# Altium schematic sheet Sheet0-MCU.SchDoc
size A4; SheetNumber: 1; SheetTotal: 4
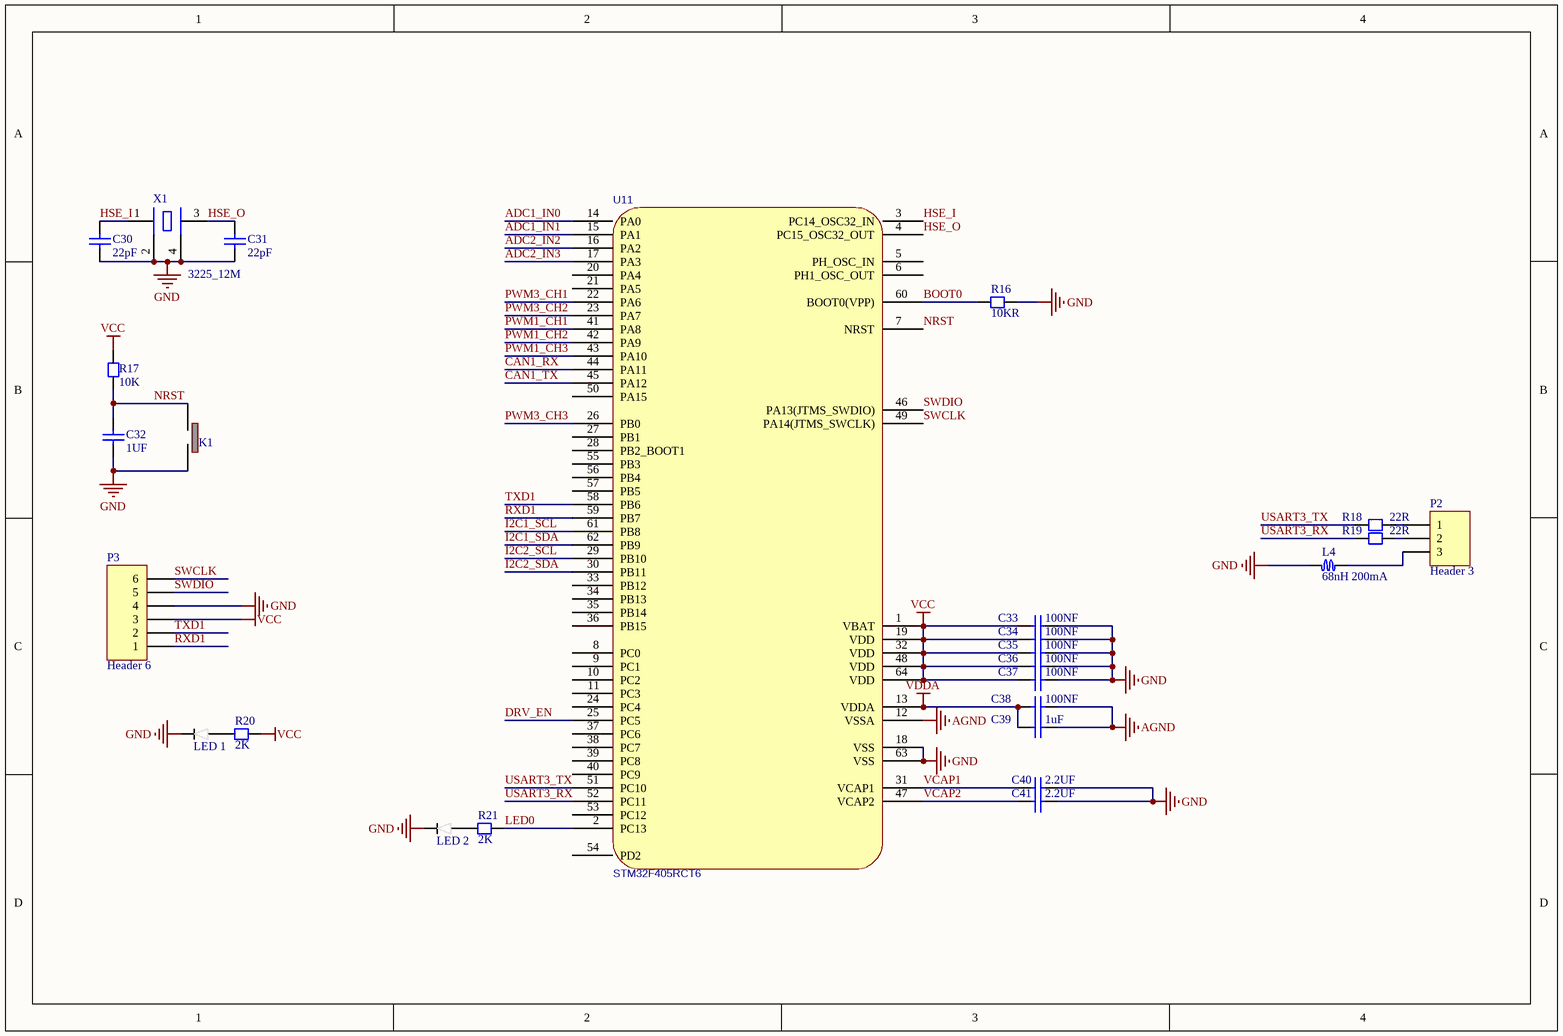
[diagram p0: Sheet0-MCU.SchDoc]

## Parts
C30  22pF  [CC1608-0603]
C31  22pF  [CC1608-0603]
C32  1UF  [CC1608-0603]
C33  100NF  [CC1608-0603]
C34  100NF  [CC1608-0603]
C35  100NF  [CC1608-0603]
C36  100NF  [CC1608-0603]
C37  100NF  [CC1608-0603]
C38  100NF  [CC1608-0603]
C39  1uF  [CC1608-0603]
C40  2.2UF  [CC1608-0603]
C41  2.2UF  [CC1608-0603]
K1  KEY 3*4  [KEY 3*4]  (value not drawn)
L4  68nH 200mA  [Inductor-0603]
LED_1  LED 0603  [LED 0603]  (value not drawn)
LED_2  LED 0603  [LED 0603]  (value not drawn)
P2  Header 3  [HX2.54-3]
P3  Header 6  [HDR1X6]
R16  10KR  [CR1608-0603]
R17  10K  [CR1608-0603]
R18  22R  [CR1608-0603]
R19  22R  [CR1608-0603]
R20  2K  [CR1608-0603]
R21  2K  [CR1608-0603]
U11  STM32F405RCT6  [LQFNP64]
X1  3225_12M  [XTAL-3225]

## Nets
AGND: C38.1 C39.1 U11.12(VSSA)
GND: C30.1 C31.1 C32.1 C33.1 C34.1 C35.1 C36.1 C37.1 C40.2 C41.1 K1.2 L4.2 LED_1.2 LED_2.2 P3.4 R16.1 U11.18(VSS) U11.63(VSS) X1.2(GND) X1.4(GND)
VCC: C33.2 C34.2 C35.2 C36.2 C37.2 P3.3 R17.2 R20.2 U11.1(VBAT) U11.19(VDD) U11.32(VDD) U11.48(VDD) U11.64(VDD)
VDDA: C38.2 C39.2 U11.13(VDDA)
ADC1_IN0: U11.14(PA0)
ADC1_IN1: U11.15(PA1)
ADC2_IN2: U11.16(PA2)
ADC2_IN3: U11.17(PA3)
BOOT0: R16.2 U11.60(BOOT0(VPP))
CAN1_RX: U11.44(PA11)
CAN1_TX: U11.45(PA12)
DRV_EN: U11.25(PC5)
HSE_I: C30.2 U11.3(PC14_OSC32_IN) X1.1(OSC1)
HSE_O: C31.2 U11.4(PC15_OSC32_OUT) X1.3(OSC2)
I2C1_SCL: U11.61(PB8)
I2C1_SDA: U11.62(PB9)
I2C2_SCL: U11.29(PB10)
I2C2_SDA: U11.30(PB11)
LED0: R21.2 U11.2(PC13)
NRST: C32.2 K1.1 R17.1 U11.7(NRST)
PWM1_CH1: U11.41(PA8)
PWM1_CH2: U11.42(PA9)
PWM1_CH3: U11.43(PA10)
PWM3_CH1: U11.22(PA6)
PWM3_CH2: U11.23(PA7)
PWM3_CH3: U11.26(PB0)
RXD1: P3.1 U11.59(PB7)
SWCLK: P3.6 U11.49(PA14(JTMS_SWCLK))
SWDIO: P3.5 U11.46(PA13(JTMS_SWDIO))
TXD1: P3.2 U11.58(PB6)
USART3_RX: R19.1 U11.52(PC11)
USART3_TX: R18.1 U11.51(PC10)
VCAP1: C40.1 U11.31(VCAP1)
VCAP2: C41.2 U11.47(VCAP2)
NetL4_1: L4.1 P2.3
NetLED_1_1: LED_1.1 R20.1
NetLED_2_1: LED_2.1 R21.1
NetP2_1: P2.1 R18.2
NetP2_2: P2.2 R19.2

Not connected (* = marked no-connect by the designer): U11 5(PH_OSC_IN) 6(PH1_OSC_OUT) 8(PC0) 9(PC1) 10(PC2) 11(PC3) 20(PA4) 21(PA5) 24(PC4) 27(PB1) 28(PB2_BOOT1) 33(PB12) 34(PB13) 35(PB14) 36(PB15) 37(PC6) 38(PC7) 39(PC8) 40(PC9) 50(PA15) 53(PC12) 54(PD2) 55(PB3) 56(PB4) 57(PB5)

## Library data of the parts
C30-C41 = Cap Chip 0603: 0603封装的电容; Published: 8-Jun-2000; Revision: July-2002: Re-released for DXP Platform.; Publisher: Altium Limited
K1 = KEY 3*4: 轻触开关按键
L4 = Inductor-0603: 贴片电感 0603封装
P2 = Header 3: Header, 3-Pin; LatestRevisionDate: 17-Jul-2002; LatestRevisionNote: Re-released for DXP Platform.; Publisher: Altium Limited
P3 = Header 6: Header, 6-Pin; LatestRevisionDate: 17-Jul-2002; LatestRevisionNote: Re-released for DXP Platform.; Publisher: Altium Limited
R16-R21 = Resistor Chip 0603: 0603封装电阻; Published: 8-Jun-2000; Revision: July-2002: Re-released for DXP Platform.; Publisher: Altium Limited
U11 = STM32F405RCT6: Contributor: czycb; spicePre: U; spiceSymbolName: STM32F405RCT6
X1 = XTAL 3225: 3225封装的晶振